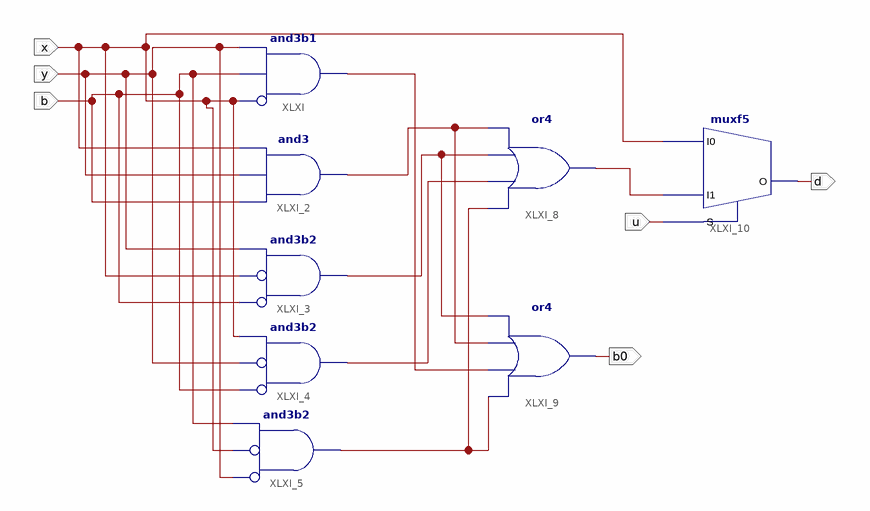
[diagram p0: schematic sheet 1]
// Xilinx ISE schematic raizInterno.sch (spartan3e) as structural Verilog: 8 symbols, 6 ports
module raizInterno (
  input  u,
  input  x,
  input  y,
  input  b,
  output d,
  output b0
);

  wire XLXN_18, XLXN_20, XLXN_22, XLXN_24, XLXN_25, XLXN_26;

  and XLXI (XLXN_18, ~x, b, y);  // and3b1
  and XLXI_2 (XLXN_22, b, y, x);
  and XLXI_3 (XLXN_24, ~b, ~x, y);  // and3b2
  and XLXI_4 (XLXN_25, ~b, ~y, x);  // and3b2
  and XLXI_5 (XLXN_20, ~y, ~x, b);  // and3b2
  or XLXI_8 (XLXN_26, XLXN_20, XLXN_25, XLXN_24, XLXN_22);
  or XLXI_9 (b0, XLXN_20, XLXN_18, XLXN_22, XLXN_24);
  muxf5 XLXI_10 (.I0(x), .I1(XLXN_26), .S(u), .O(d));
endmodule
